# Altium schematic sheet Test.SchDoc
size A4; SheetNumber: 2; SheetTotal: 2
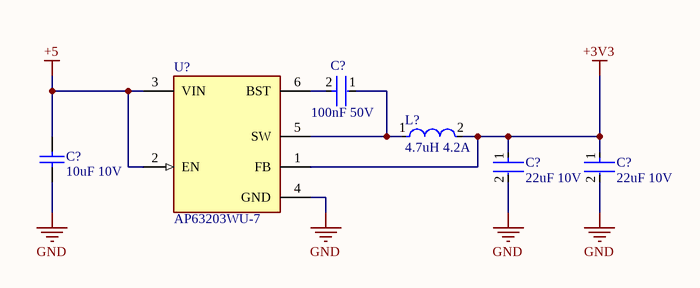
[diagram p0: Test.SchDoc]

## Parts
(Parts that share a designator on the sheet are numbered #1, #2 ... from top to bottom, then left to right.)
C?#1  100nF 50V  [FP-GCJ188-0_2-IPC_C]
C?#2  22uF 10V  [FP-1206Q-MFG]
C?#3  22uF 10V  [FP-1206Q-MFG]
C?#4  10uF 10V  [CAPC3216X180X55LL20T25]
L?  4.7uH 4.2A  [FP-IHLP-2525CZ-FP_2_413x3-MFG]
U?  AP63203WU-7  [FP-TSOT26-MFG]

## Nets
+3V3: C?#2.1 C?#3.1 L?.2 U?.1(FB)
+5: C?#4.2 U?.2(EN) U?.3(VIN)
GND: C?#2.2 C?#3.2 C?#4.1 U?.4(GND)
NetC?#1_1: C?#1.1 L?.1 U?.5(SW)
NetC?#1_2: C?#1.2 U?.6(BST)

## Library data of the parts
C?#1 = CMP-2006-02223-2: Cap Ceramic 0.1uF 50V X7R 10% Pad SMD 0603 Soft Termination +125°C Automotive T/R; Radiation Hardening: No; Dielectric: X7R; Voltage Rating (DC): 50V; Case Code (Imperial): 0603; Length: 1.6mm; Features: Soft Termination; Case Code (Metric): 1608; Case/Package: 0603; Termination: SMD/SMT; Packaging: Tape and Reel; Height: 0.8mm; Tolerance: 10%; Thickness: 0.035inch; Width: 0.031inch; Voltage Rating: 50V; Min Operating Temperature: -55°C; Ratings: AEC-Q200; Package Quantity: 1; Capacitance: 100nF; Depth: 0.8mm; Mount: Surface Mount; Lead Free: Lead Free; Max Operating Temperature: 125°C
C?#2 C?#3 = CMP-04427-000069-1: CAP CER 22UF 10V X7R 1206; Dissipation Factor: 5%; Tolerance: 10%; Depth: 1.6mm; REACH SVHC: No SVHC; Length: 3.2mm; Dielectric: X7R; Voltage Rating (DC): 10V; Width: 0.063inch; Case Code (Metric): 3216; Capacitance: 22uF; Voltage: 10V; Mount: Surface Mount; Voltage Rating: 10V; Termination: SMD/SMT; Min Operating Temperature: -55°C; Series: -; Package Quantity: 2500; Max Operating Temperature: 125°C; Construction: Flat; RoHS Compliant: Yes; Thickness: 0.071inch; Contact Plating: Tin; Case Code (Imperial): 1206; Lead Free: Lead Free; Packaging: Cut Tape; Case/Package: 1206
C?#4 = CMP-2000-06349-1: Chip Monolithic Ceramic Capacitor, 10 uF, 10 V, +/- 10%, -55 to 125 degC, 1206 (3216 Metric), RoHS, Tape and Reel; Manufacturer: Murata; Catalog Drawings: GRMSeries_1206_1.6; Featured Product: GA3SafetyRecognizedCapsandHi-CapMLCC; Online Catalog: GRMSeries; Capacitance: 10µF; Temperature Coefficient: X7R; Other Names: 490-3371-6; Product Training Modules: High-CapMultilayerCeramicCapacitors; Voltage - Rated: 10V; Applications: GeneralPurpose; Mounting Technology: SurfaceMount; Operating Temperature: -55°C~125°C; Lead Spacing: -; Package / Case: 1206(3216Metric); Category: Capacitors; Family: CeramicCapacitors; Ratings: -; Tolerance: ±10%; Series: GRM; Thickness (Max): 0.071"(1.80mm); Package Reference: 1206; Size / Dimension: 0.126"Lx0.063"W(3.20mmx1.60mm); Packaging: Digi-Reel®; Datasheet URL: http://search.murata.co.jp/Ceramy/image/img/A01X/G101/ENG/GRM31CR71A106KA01-01.pdf; Mounting Type: SurfaceMount,MLCC; Features: -; Standard Package: 1; Package Description: 2-Pin Surface Mount Device, Body 3.2 x 1.6 mm; Datasheet Version: 02/2016; Lead Style: -; Manufacturer URL: http://www.murata.com/; Height - Seated (Max): -
L? = CMP-02424-000538-1: Commercial Inductors, High Saturation Series 4.7uH 5.5A 40mΩ 20%; DC Resistance (DCR): 40mR; Max DC Current: 10A; Shielding: Shielded; Test Frequency: 100kHz; Self Resonant Frequency: 5MHz; Core Material: Metal; Height: 3mm; Depth: 6.72mm; Inductance Tolerance: 20%; Inductance: 4.7uH; Number of Pins: 2; Military Standard: Not; Min Operating Temperature: -55°C; Mount: Surface Mount; Saturation Current: 10A; Case/Package: 2525; Case Code (Metric): 6363; Packaging: Tape and Reel; Width: 0.255inch; Current Rating: 5.5A; Package Quantity: 2000; Termination: SMD/SMT; Case Code (Imperial): 2525; Lead Free: Lead Free; Contact Plating: Tin; Max Operating Temperature: 125°C; Tolerance: 20%; Length: 7.24mm; Radiation Hardening: No; Height - Seated (Max): 0.118inch; RMS Current (Irms): 5.5A
U? = CMP-12757-000006-1: IC REG BUCK 3.3V 2A TSOT26; Manufacturer: Diodes Inc.; Description: Buck Switching Regulator IC Positive Fixed 3.3V 1 Output 2A SOT-23-6 Thin, TSOT-23-6; Output Type: Fixed; Min Supply Voltage: 3.8V; Number Of Outputs: 1; Max Junction Temp: +160°C; Nominal Supply Current: 22uA; Standoff Height: 0.01mm; Switching Frequency: 1.1MHz; Max Supply Voltage: 32V; ComponentLink2Description: Datasheet; Device Class L1: Integrated Circuits (ICs); Temperature: to +160°C; Device Class L3: Voltage Regulators - Switching; RoHS: TRUE; Octopart: https://octopart.com/ap63203wu-7-diodes+inc.-98099550; Output Voltage: 3.3V; Lead Free: Yes; ComponentLink2URL: https://www.diodes.com/assets/Datasheets/AP63200-AP63201-AP63203-AP63205.pdf; Digikey Description: IC REG BUCK 3.3V 2A TSOT26; Footprint Url: https://www.diodes.com/assets/Package-Files/TSOT26.pdf; Ambient Temperature Range High: +85°C; Height: 1mm; Automotive: No; Temperature Range High: +160°C; Switching Topology: Buck; Output Current: 2A; Package: TSOT26; Category: IC; Mouser Description: AP63203 Series 3.3 V 2 A SMT Fixed Low IQ Synchronous Buck - TSOT-26; Device Class L2: Power Management ICs; Ambient Temperature Range Low: -40°C; Manufacturer Part Number: AP63203WU-7